# Altium schematic sheet ADC.SchDoc
size A4
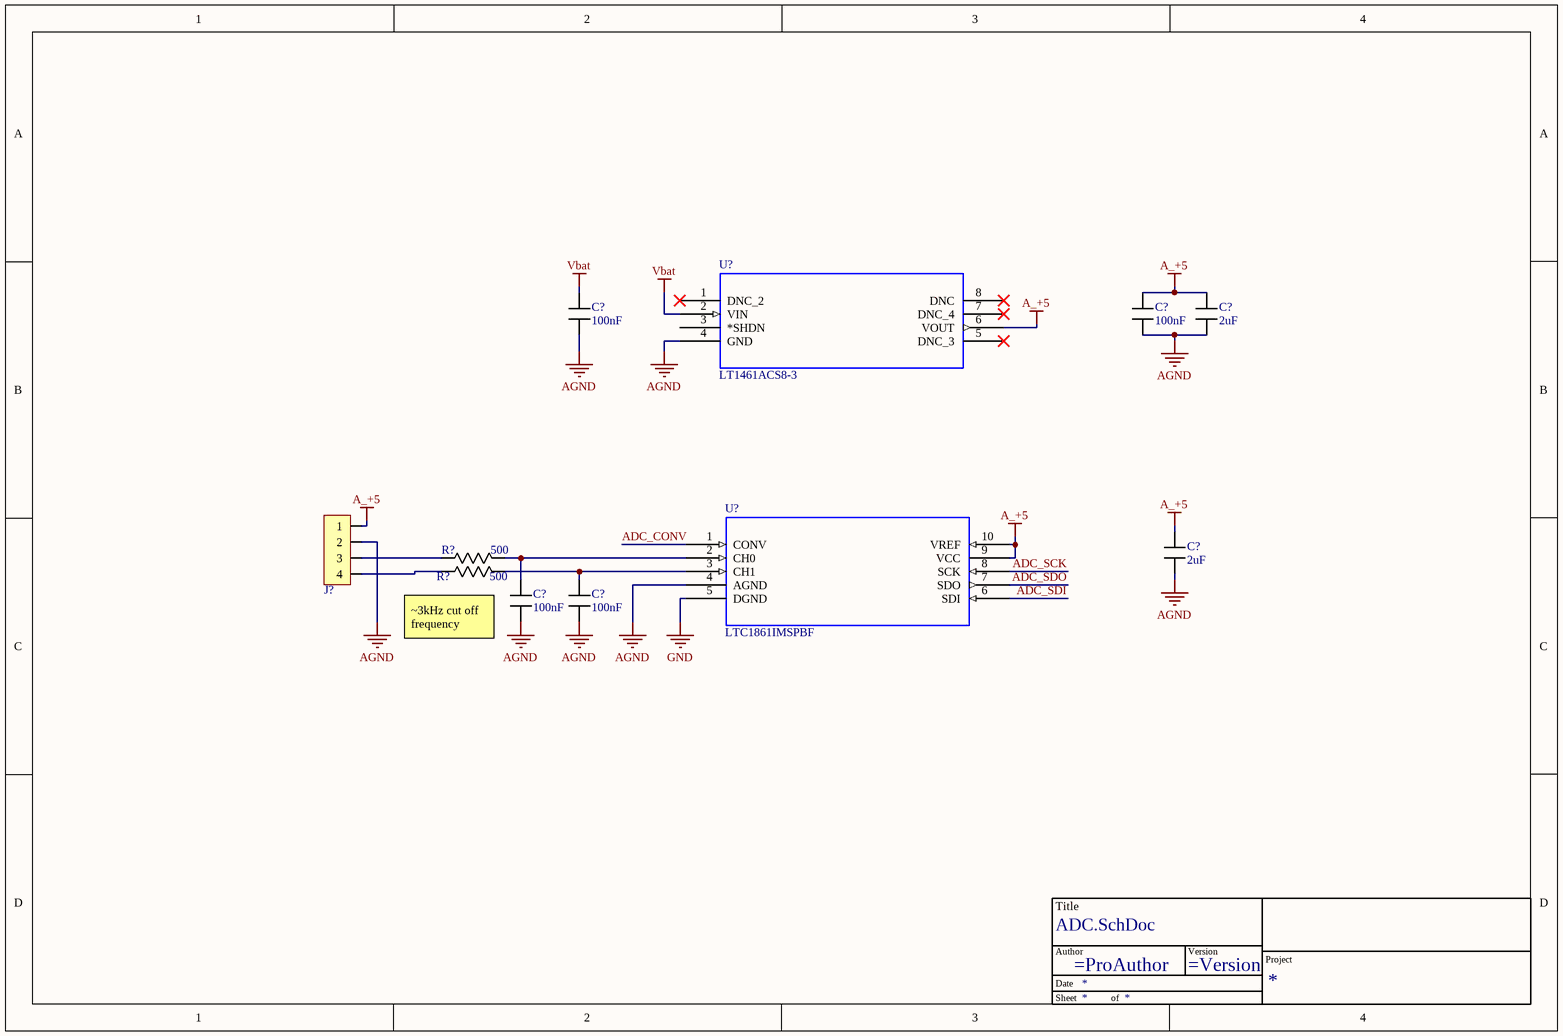
[diagram p0: ADC.SchDoc]

## Parts
(Parts that share a designator on the sheet are numbered #1, #2 ... from top to bottom, then left to right.)
*  TitleBlock  (value not drawn)  (graphical)
C?#1  value 100nF  [C_0603]  (hidden comment: C)
C?#2  value 100nF  [C_0603]  (hidden comment: C)
C?#3  value 2uF  [C_0603]  (hidden comment: C)
C?#4  value 2uF  [C_0603]  (hidden comment: C)
C?#5  value 100nF  [C_0603]  (hidden comment: C)
C?#6  value 100nF  [C_0603]  (hidden comment: C)
J?  3-794632-4  [3-794632-4]  (value not drawn)
R?#1  value 500  [R-0603]  (hidden comment: Resistor)
R?#2  value 500  [R-0603]  (hidden comment: Resistor)
U?#1  LT1461ACS8-3  [SO-8_S]
U?#2  LTC1861IMSPBF  [MSOP-10_MS]

## Nets
A_+5: C?#2.2 C?#3.2 C?#4.2 J?.1 U?#1.6(VOUT) U?#2.9(VCC) U?#2.10(VREF)
AGND: C?#1.1 C?#2.1 C?#3.1 C?#4.1 C?#5.1 C?#6.1 J?.2 U?#1.4(GND) U?#2.4(AGND)
GND: U?#2.5(DGND)
Vbat: C?#1.2 U?#1.2(VIN)
ADC_CONV: U?#2.1(CONV)
ADC_SCK: U?#2.8(SCK)
ADC_SDI: U?#2.6(SDI)
ADC_SDO: U?#2.7(SDO)
NetC?#5_2: C?#5.2 R?#1.2 U?#2.2(CH0)
NetC?#6_2: C?#6.2 R?#2.2 U?#2.3(CH1)
NetJ?_3: J?.3 R?#1.1
NetJ?_4: J?.4 R?#2.1

Not connected (* = marked no-connect by the designer): U?#1 1(DNC_2)* 3(*SHDN) 5(DNC_3)* 7(DNC_4)* 8(DNC)*

## Notes on the sheet
- ~3kHz cut off frequency
- (in symbol TitleBlock) Title; Author; Version; Project; Date; Sheet; of

## Library data of the parts
C?#1-C?#6 = Capacitor: ComponentLink1Description: New link; ComponentLink1URL: *
J? = 3-794632-4: Conn Power HDR 4 POS 3mm Solder ST Thru-Hole 4 Terminal 1 Port Box/Tray; Manufacturer: TE Connectivity; Number of Terminals/Pins: 4; Max Voltage Rating (AC): 250V; Connector Type: Pin; Mating Retention: Yes (With); PCB Mount Alignment: No (Without); Current Rating: 5A; Number of Ports: 1; Connector System: Wire-to-Board; PCB Mount Retention: With; PCB Mounting Orientation: Vertical; VDE Tested: Yes; Pitch: 0.118inch; Row Spacing: 0.118mm; PCB Thickness: 1.57mm; Plating Thickness: 2.54um; Approvals: CSA; Supplier 1: Mouser; Manufacturer Part Number: 3-794632-4; RoHS: Yes; Category: Power Connectors; Stock 1: 833; Pricing 1: 1=1.68000, 10=1.43000, 50=1.43000, 100=1.24000, 377=1.09000, 1000=1.09000, 1131=0.93600, 2639=0.87300, 5278=0.83000, 10000=0.83000, 10179=0.81100, 25259=0.79100 (USD); Mount: Through Hole; Housing Color: Black; Contact Material: Brass; Color: Black; Housing Material: Nylon; Contact Plating: Gold,Tin; Min Operating Temperature: -40°C; Max Operating Temperature: 221°C; Packaging: Tray; Package Quantity: 377; Number of Rows: 2; Fastening Type: Ramp; Orientation: Straight; Number of Positions: 4; Termination: Solder; Number of Contacts: 4; Voltage Rating: 250V; Contact Gender: Male; Mating Alignment: Yes (With); Contact Current Rating: 5A; Contact Retention: No (Without); Sealable: No (Without); Circuit Application: Power; Number of Power Positions: 4; Length: 10mm; Width: 9.24mm; Height: 8.67mm; Depth: 8.67mm; Radiation Hardening: No; Flammability Rating: UL94 V-0; Lead Free: Lead Free; ELV: Compliant; ComponentLink1URL: https://datasheet.ciiva.com/717/eng-cd-794632-e-717814.pdf?src-supplier=Digi-Key; ComponentLink1Description: https://datasheet.ciiva.com/717/eng-cd-794632-e-717814.pdf?src-supplier=Digi-Key; ComponentLink2URL: https://datasheet.ciiva.com/30185/eng-cs-82181-softshell-high-density-0508-30185662.pdf?src-supplier=Onlinecomponents.com; ComponentLink2Description: https://datasheet.ciiva.com/30185/eng-cs-82181-softshell-high-density-0508-30185662.pdf?src-supplier=Onlinecomponents.com; Supplier Part Number 1: 571-3-794632-4
U?#1 = LT1461ACS8-3: MF: {'manufacturer': u'Analog Devices / Linear Technology'}; Price: None; Value: *; Availability: Unavailable; MP: LT1461ACS8-3; Package: None
U?#2 = LTC1861IMSPBF: MF: {'manufacturer': u'Analog Devices'}; Price: None; Value: *; Availability: Unavailable; MP: LTC1861IMSPBF; Package: None